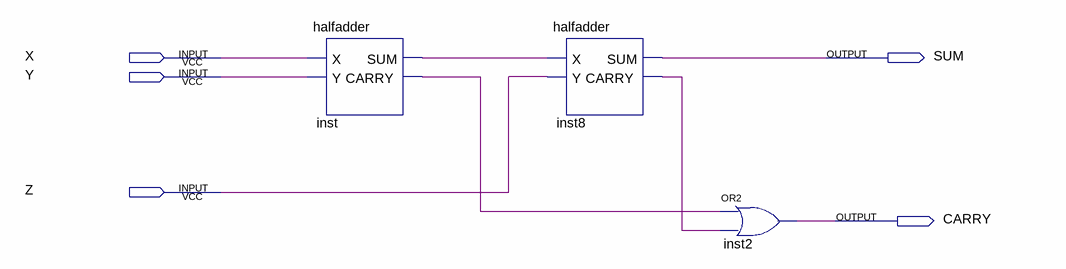
[diagram p0: schematic sheet]
// Quartus schematic Q2.bdf as structural Verilog: 3 symbols, 5 pins
module Q2 (
  input  X,
  input  Y,
  input  Z,
  output SUM,
  output CARRY
);

  wire inst8_carry, inst_carry, inst_sum;

  halfadder inst (.X(X), .Y(Y), .SUM(inst_sum), .CARRY(inst_carry));
  halfadder inst8 (.X(inst_sum), .Y(Z), .SUM(SUM), .CARRY(inst8_carry));
  or inst2 (CARRY, inst_carry, inst8_carry);
endmodule
